# EAGLE schematic scoreboard (EAGLE 7.5.0)
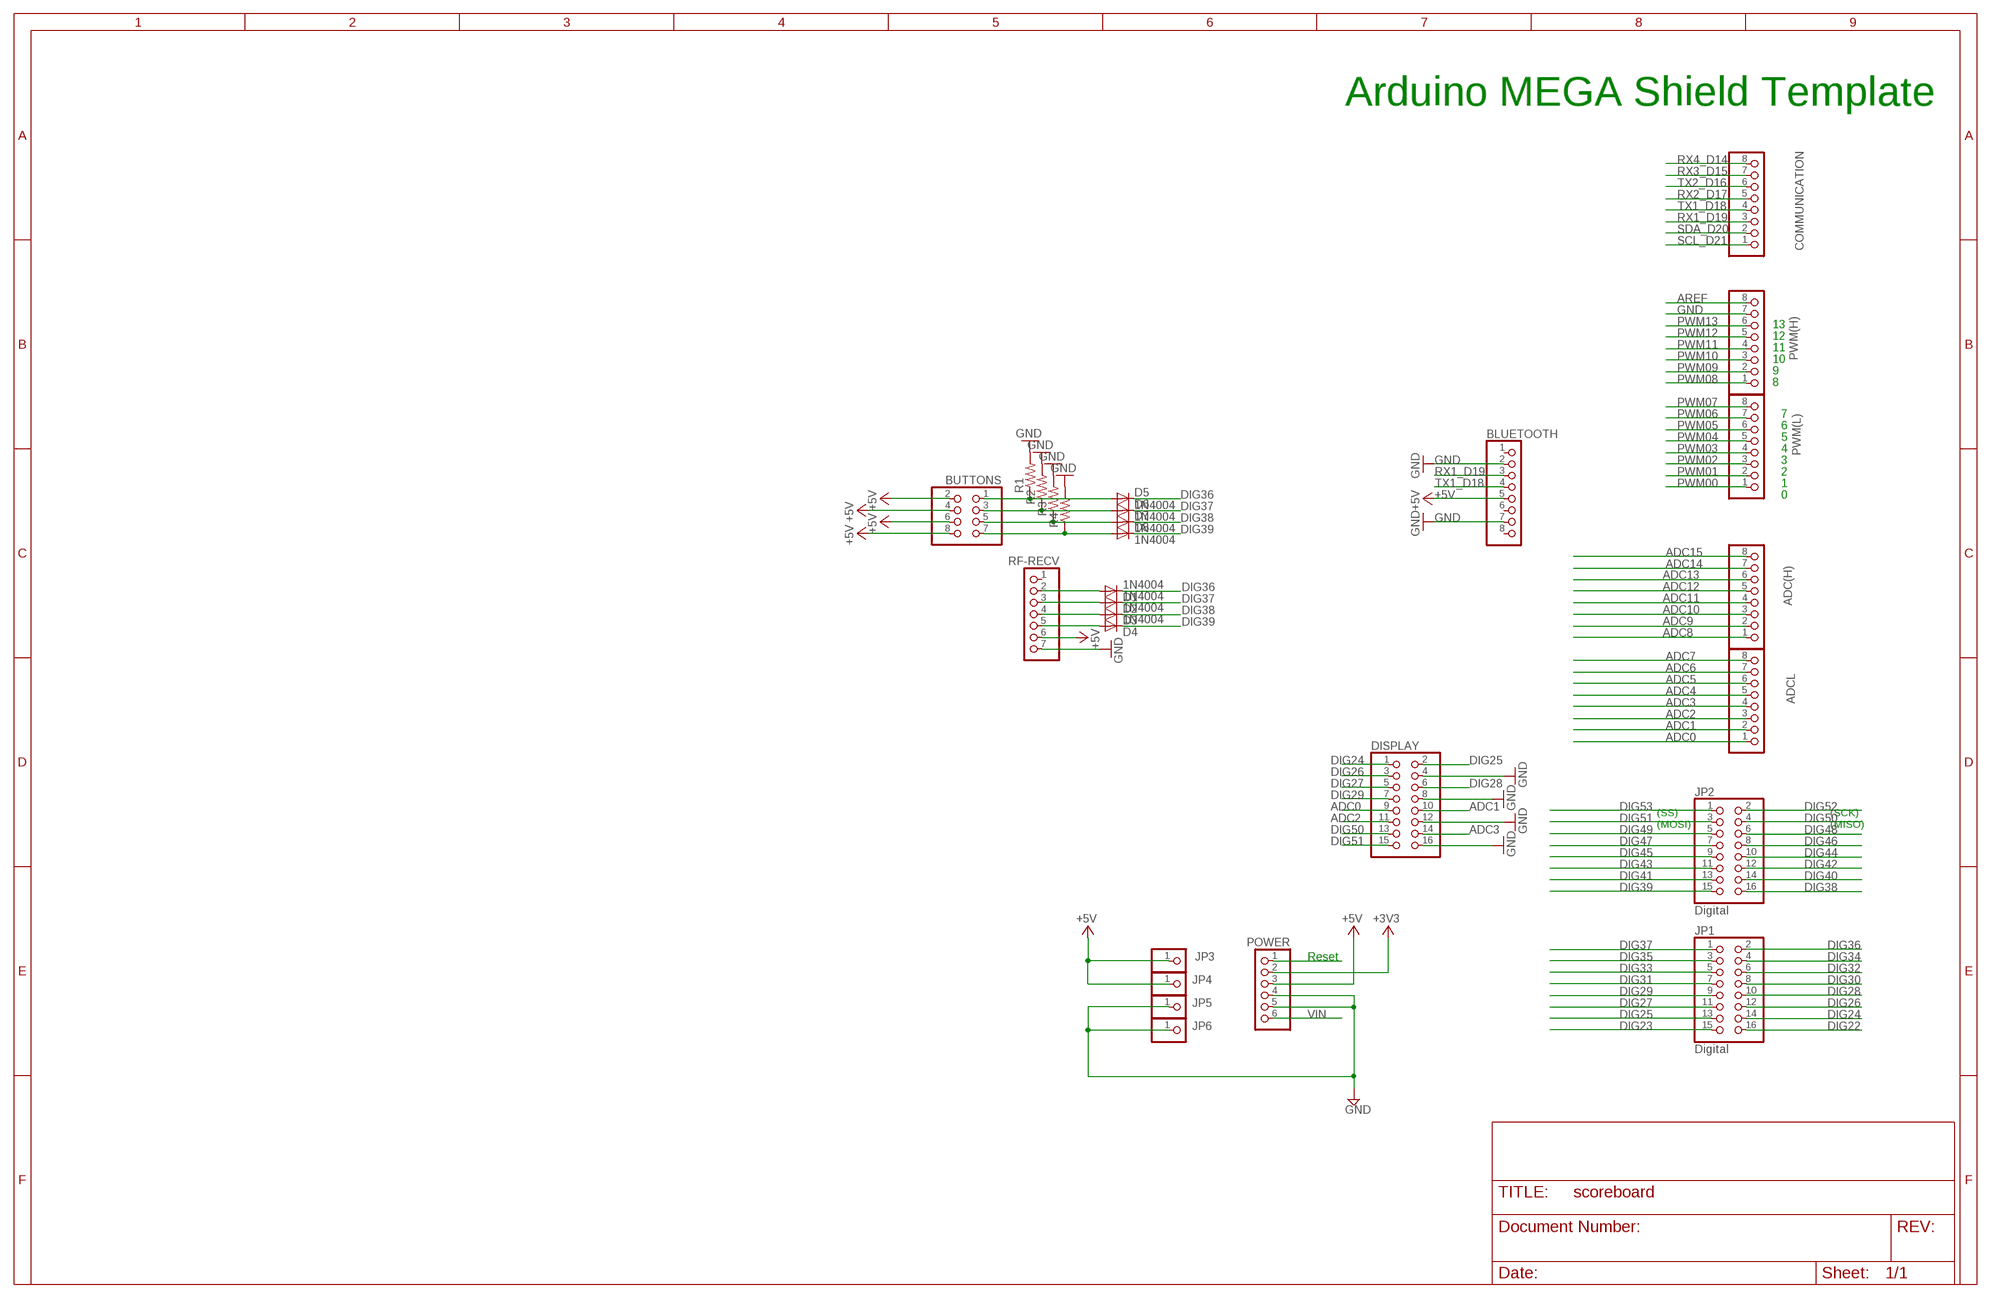
[diagram p0: schematic, sheet 1]

## Parts
ADC(H)  PINHD-1X8  [1X08]
ADCL  PINHD-1X8  [1X08]
BLUETOOTH  PINHD-1X8  [1X08]
BUTTONS  PINHD-2X4  [2X04]
COMMUNICATION  PINHD-1X8  [1X08]
D1  1N4004  [DO41-10]
D2  1N4004  [DO41-10]
D3  1N4004  [DO41-10]
D4  1N4004  [DO41-10]
D5  1N4004  [DO41-10]
D6  1N4004  [DO41-10]
D7  1N4004  [DO41-10]
D8  1N4004  [DO41-10]
DISPLAY  PINHD-2X8  [2X08]
JP1  Digital  PINHD-2X8  [2X08]
JP2  Digital  PINHD-2X8  [2X08]
JP3  PINHD-1X1  [1X01]
JP4  PINHD-1X1  [1X01]
JP5  PINHD-1X1  [1X01]
JP6  PINHD-1X1  [1X01]
POWER  PINHD-1X6  [1X06]
PWM(H)  PINHD-1X8  [1X08]
PWM(L)  PINHD-1X8  [1X08]
R1  FLIPFLOP-RES  [0805-THM]
R2  FLIPFLOP-RES  [0805-THM]
R3  FLIPFLOP-RES  [0805-THM]
R4  FLIPFLOP-RES  [0805-THM]
RF-RECV  PINHD-1X7  [1X07]

## Nets
+3V3 [power]: POWER.2
+5V [usbvcc]: BLUETOOTH.5 BUTTONS.2 BUTTONS.4 BUTTONS.6 BUTTONS.8 JP3.1 JP4.1 POWER.3 RF-RECV.6
ADC0: ADCL.1 DISPLAY.9
ADC1: ADCL.2 DISPLAY.10
ADC2: ADCL.3 DISPLAY.11
ADC3: ADCL.4 DISPLAY.14
ADC4: ADCL.5
ADC5: ADCL.6
ADC6: ADCL.7
ADC7: ADCL.8
ADC8: ADC(H).1
ADC9: ADC(H).2
ADC10: ADC(H).3
ADC11: ADC(H).4
ADC12: ADC(H).5
ADC13: ADC(H).6
ADC14: ADC(H).7
ADC15: ADC(H).8
AREF: PWM(H).8
DIG22: JP1.16
DIG23: JP1.15
DIG24: DISPLAY.1 JP1.14
DIG25: DISPLAY.2 JP1.13
DIG26 [gnd]: DISPLAY.3 JP1.12
DIG27: DISPLAY.5 JP1.11
DIG28: DISPLAY.6 JP1.10
DIG29: DISPLAY.7 JP1.9
DIG30: JP1.8
DIG31: JP1.7
DIG32: JP1.6
DIG33: JP1.5
DIG34: JP1.4
DIG35: JP1.3
DIG36: D1.C D5.C JP1.2
DIG37: D2.C D6.C JP1.1
DIG38: D3.C D7.C JP2.16
DIG39: D4.C D8.C JP2.15
DIG40: JP2.14
DIG41: JP2.13
DIG42: JP2.12
DIG43: JP2.11
DIG44: JP2.10
DIG45: JP2.9
DIG46: JP2.8
DIG47: JP2.7
DIG48: JP2.6
DIG49: JP2.5
DIG50: DISPLAY.13 JP2.4
DIG51: DISPLAY.15 JP2.3
DIG52: JP2.2
DIG53: JP2.1
GND [gnd]: BLUETOOTH.2 BLUETOOTH.7 DISPLAY.4 DISPLAY.8 DISPLAY.12 DISPLAY.16 JP5.1 JP6.1 POWER.4 POWER.5 PWM(H).7 R1.2 R2.2 R3.2 R4.2 RF-RECV.7
N$1: D1.A RF-RECV.2
N$2: D2.A RF-RECV.3
N$3: D3.A RF-RECV.4
N$4: D4.A RF-RECV.5
N$19: BUTTONS.1 D5.A R1.1
N$20: BUTTONS.3 D6.A R2.1
N$21: BUTTONS.5 D7.A R3.1
N$22: BUTTONS.7 D8.A R4.1
PWM00: PWM(L).1
PWM01: PWM(L).2
PWM02: PWM(L).3
PWM03: PWM(L).4
PWM04: PWM(L).5
PWM05: PWM(L).6
PWM06: PWM(L).7
PWM07: PWM(L).8
PWM08: PWM(H).1
PWM09: PWM(H).2
PWM10: PWM(H).3
PWM11: PWM(H).4
PWM12: PWM(H).5
PWM13: PWM(H).6
RESET: POWER.1
RX1_D19: BLUETOOTH.3 COMMUNICATION.3
RX2_D17: COMMUNICATION.5
RX3_D15: COMMUNICATION.7
RX4_D14: COMMUNICATION.8
SCL_D21: COMMUNICATION.1
SDA_D20: COMMUNICATION.2
TX1_D18: BLUETOOTH.4 COMMUNICATION.4
TX2_D16: COMMUNICATION.6
VIN [power]: POWER.6
Unconnected: BLUETOOTH.1 BLUETOOTH.6 BLUETOOTH.8 RF-RECV.1

## Notes on the sheet
- Arduino MEGA Shield Template
- 13
- 12
- 11
- 10
- 9
- 8
- 7
- 6
- 5
- 4
- 3
- 2
- 1
- 0
- (SS) | (SCK)
- (MOSI) | (MISO)
- Reset

## Library data of the parts
ADC(H) ADCL BLUETOOTH COMMUNICATION PWM(H) PWM(L) = pinhead:PINHD-1X8: PIN HEADER
BUTTONS = pinhead:PINHD-2X4: PIN HEADER
D1-D8 = adafruit:1N4004: DIODE General purpose 1N400x type rectifier (With bigger pads) http://www.ladyada.net/library/pcb/eaglelibrary.html
DISPLAY JP1 JP2 = pinhead:PINHD-2X8: PIN HEADER
JP3-JP6 = pinhead:PINHD-1X1: PIN HEADER
POWER = pinhead:PINHD-1X6: PIN HEADER
R1-R4 = adafruit:FLIPFLOP-RES: Flip Flop resistor An 0805 resistor inside a standard 1/4W 5% resistor. Makes for easy mods
RF-RECV = pinhead:PINHD-1X7: PIN HEADER

## Net classes
0 default: width 0.203 mm, drill 0.406 mm, clearance 0.203 mm
1 power: width 0.61 mm, drill 0.711 mm, clearance 0.203 mm
2 gnd: width 0.305 mm, drill 0.711 mm, clearance 0.203 mm
3 usbvcc: width 0.508 mm, drill 0.711 mm, clearance 0.203 mm